# EAGLE schematic RadioLab (EAGLE 6.5.0)
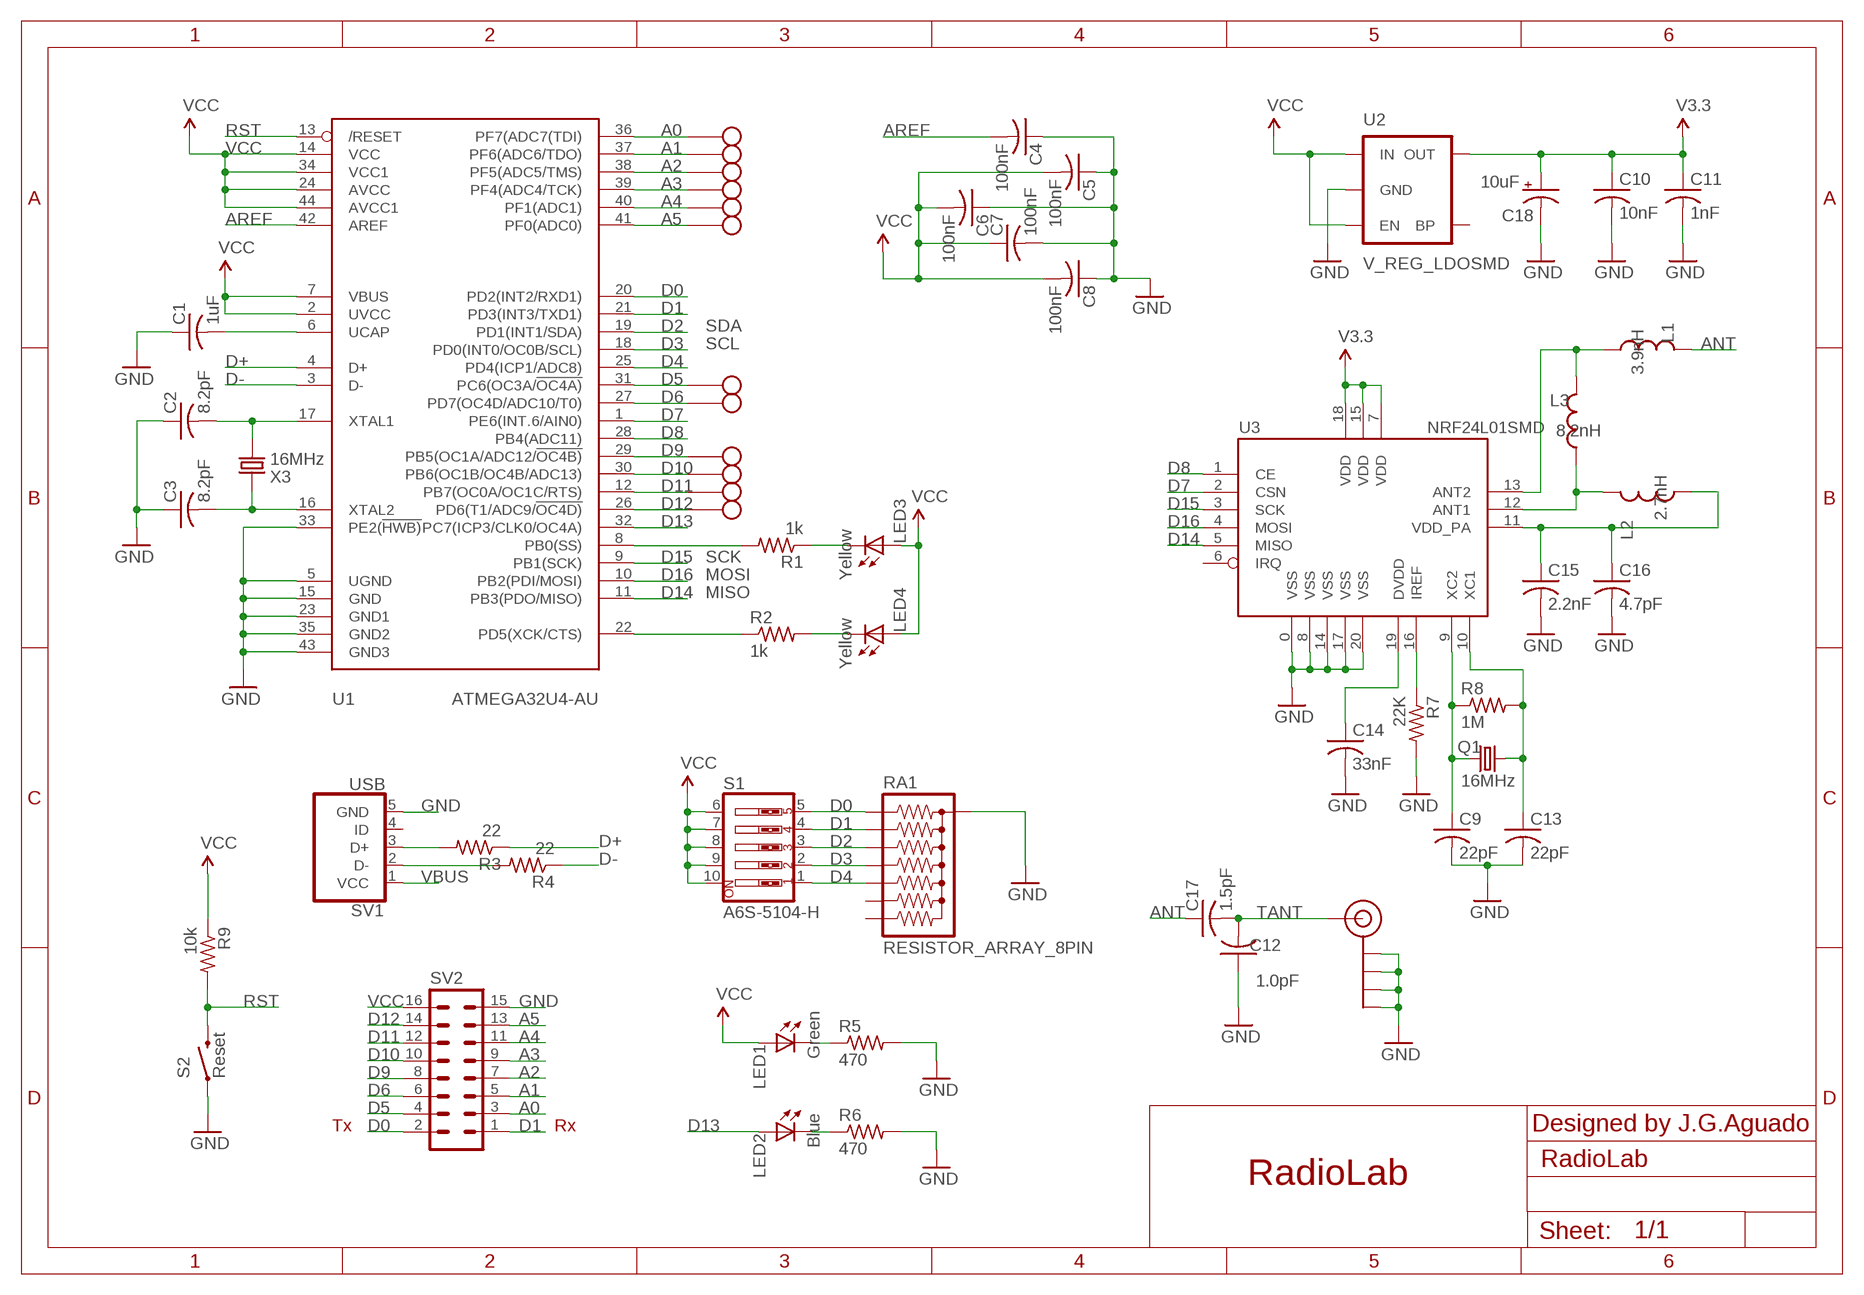
[diagram p0: schematic, sheet 1]

## Parts
ANT  SMA_EDGE  [SMA-EDGE]
C1  1uF  C0402  [0402]
C2  8.2pF  C0402  [0402]
C3  8.2pF  C0402  [0402]
C4  100nF  C0402  [0402]
C5  100nF  C0402  [0402]
C6  100nF  C0402  [0402]
C7  100nF  C0402  [0402]
C8  100nF  C0402  [0402]
C9  22pF  C0402  [0402]
C10  10nF  C0402  [0402]
C11  1nF  C0402  [0402]
C12  1.0pF  C0402  [0402]
C13  22pF  C0402  [0402]
C14  33nF  C0402  [0402]
C15  2.2nF  C0402  [0402]
C16  4.7pF  C0402  [0402]
C17  1.5pF  C0402  [0402]
C18  10uF  CAP_POL1206  [EIA3216]
L1  3.9nH  L0402  [0402]
L2  2.7nH  L0402  [0402]
L3  8.2nH  L0402  [0402]
LED1  Green  LED0402  [LED0402]
LED2  Blue  LED0402  [LED0402]
LED3  Yellow  LED0402  [LED0402]
LED4  Yellow  LED0402  [LED0402]
Q1  16MHz  CRYSTAL5X3  [CRYSTAL-SMD-5X3]
R1  1k  R0402  [0402]
R2  1k  R0402  [0402]
R3  22  R0402  [0402]
R4  22  R0402  [0402]
R5  470  R0402  [0402]
R6  470  R0402  [0402]
R7  22K  R0402  [0402]
R8  1M  R0402  [0402]
R9  10k  R0402  [0402]
RA1  RESISTOR_ARRAY_8PIN  [CRA12E]
S1  A6S-5104-H  [A6S-5104-H]
S2  Reset  SWITCH-MOMENTARY-2SMD-4  [TACTILE_SWITCH_TALL]
SV1  USB  USB-RECEPTABLE  [FCI-10103594-0001LF]
SV2  MA08-2  [MA08-2]
U1  ATMEGA32U4-AU  [TQFP44]
U2  V_REG_LDOSMD  [SOT23-5]
U3  NRF24L01SMD  [QFN20]
U$1  PIN_PAD_CIRCLE_R50  [PAD_5MM]
U$2  PIN_PAD_CIRCLE_R50  [PAD_5MM]
U$3  PIN_PAD_CIRCLE_R50  [PAD_5MM]
U$4  PIN_PAD_CIRCLE_R50  [PAD_5MM]
U$5  PIN_PAD_CIRCLE_R50  [PAD_5MM]
U$6  PIN_PAD_CIRCLE_R50  [PAD_5MM]
U$7  PIN_PAD_CIRCLE_R50  [PAD_5MM]
U$8  PIN_PAD_CIRCLE_R50  [PAD_5MM]
U$9  PIN_PAD_CIRCLE_R50  [PAD_5MM]
U$10  PIN_PAD_CIRCLE_R50  [PAD_5MM]
U$11  PIN_PAD_CIRCLE_R50  [PAD_5MM]
U$12  PIN_PAD_CIRCLE_R50  [PAD_5MM]
X3  16MHz  CRYSTAL'5032'  [2P-SMD-5X3.2]

## Nets
3.3V: C10.1 C11.1 C18.A(+) U2.5(OUT) U3.7(VDD) U3.15(VDD) U3.18(VDD) ; supply symbol labelled V3.3
A0: SV2.3 U1.36(PF7(ADC7(TDI)) U$1.PAD
A1: SV2.5 U1.37(PF6(ADC6/TDO)) U$2.PAD
A2: SV2.7 U1.38(PF5(ADC5/TMS)) U$3.PAD
A3: SV2.9 U1.39(PF4(ADC4/TCK)) U$4.PAD
A4: SV2.11 U1.40(PF1(ADC1)) U$5.PAD
A5: SV2.13 U1.41(PF0(ADC0)) U$6.PAD
ANT: C17.1 L1.2
AREF: C4.2 U1.42(AREF)
D0: RA1.1 S1.5 SV2.2 U1.20(PD2(INT2/RXD1))
D1: RA1.2 S1.4 SV2.1 U1.21(PD3(INT3/TXD1))
D2: RA1.3 S1.3 U1.19(PD1(INT1/SDA))
D3: RA1.4 S1.2 U1.18(PD0(INT0/OC0B/SCL))
D4: RA1.5 S1.1 U1.25(PD4(ICP1/ADC8))
D5: SV2.4 U1.31(PC6(OC3A/!OC4A)) U$7.PAD
D6: SV2.6 U1.27(PD7(OC4D/ADC10/T0)) U$8.PAD
D7: U1.1(PE6(INT.6/AIN0)) U3.2(CSN)
D8: U1.28(PB4(ADC11)) U3.1(CE)
D9: SV2.8 U1.29(PB5(OC1A/ADC12/!OC4B)) U$9.PAD
D10: SV2.10 U1.30(PB6(OC1B/OC4B/ADC13)) U$10.PAD
D11: SV2.12 U1.12(PB7(OC0A/OC1C/RTS)) U$11.PAD
D12: SV2.14 U1.26(PD6(T1/ADC9/!OC4D)) U$12.PAD
D13: LED2.A U1.32(PC7(ICP3/CLK0/OC4A))
D14: U1.11(PB3(PDO/MISO)) U3.5(MISO)
D15: U1.9(PB1(SCK)) U3.3(SCK)
D16: U1.10(PB2(PDI/MOSI)) U3.4(MOSI)
D17/PB0/RXLED1: R1.2 U1.8(PB0(SS))
D+: R3.1 U1.4(D+)
D-: R4.1 U1.3(D-)
GND: ANT.GND@0(GND) ANT.GND@1(GND) ANT.GND@2(GND) ANT.GND@3(GND) C1.1 C2.1 C3.1 C4.1 C5.1 C6.1 C7.2 C8.1 C9.2 C10.2 C11.2 C12.1 C13.2 C14.2 C15.2 C16.2 C18.C(-) R5.2 R6.2 R7.2 RA1.8 S2.A2 SV1.5(GND) SV2.15 U1.5(UGND) U1.15(GND) U1.23(GND1) U1.33(PE2(!HWB)) U1.35(GND2) U1.43(GND3) U2.2(GND) U3.0(VSS) U3.8(VSS) U3.14(VSS) U3.17(VSS) U3.20(VSS)
N$1: C9.1 Q1.1 R8.1 U3.9(XC2)
N$2: R3.2 SV1.3(D+)
N$3: C2.2 U1.17(XTAL1) X3.2
N$4: R4.2 SV1.2(D-)
N$5: C13.1 Q1.3 R8.2 U3.10(XC1)
N$6: LED1.C R5.1
N$7: C3.2 U1.16(XTAL2) X3.1
N$8: L1.1 L3.2 U3.13(ANT2)
N$9: LED2.C R6.1
N$10: C15.1 C16.1 L2.1 U3.11(VDD_PA)
N$11: R7.1 U3.16(IREF)
N$12: C14.1 U3.19(DVDD)
N$13: L2.2 L3.1 U3.12(ANT1)
N$15: LED4.C R2.2
N$16: LED3.C R1.1
PD5/TXLED1: R2.1 U1.22(PD5(XCK/CTS))
RST: R9.2 S2.B2 U1.13(/RESET)
TANT: ANT.SIG(SIGNAL) C12.2 C17.2
UCAP1: C1.2 U1.6(UCAP)
VBUS: SV1.1(VCC)
VCC: C5.2 C6.2 C7.1 C8.2 LED1.A LED3.A LED4.A R9.1 S1.6 S1.7 S1.8 S1.9 S1.10 SV2.16 U1.2(UVCC) U1.7(VBUS) U1.14(VCC) U1.24(AVCC) U1.34(VCC1) U1.44(AVCC1) U2.1(IN) U2.3(EN)
Unconnected: RA1.6 RA1.7 SV1.4(ID) U2.4(BP) U3.6(IRQ)

## Notes on the sheet
- SDA
- SCL
- SCK
- MOSI
- MISO
- Tx | Rx | Designed by J.G.Aguado
- RadioLab

## Library data of the parts
ANT = SparkFun:SMA_EDGE: SMA Antenna Connector End launch SMA connector. The paste layer has been removed so that the connector can be hand soldered onto the board after reflow.
C1-C17 = SpaceDIY_passive_components:C0402
C18 = SparkFun:CAP_POL: Capacitor Polarized These are standard SMD and PTH capacitors. Normally 10uF, 47uF, and 100uF in electrolytic and tantalum varieties. Always verify the external diameter of the through hole cap, it varies with capacity, voltage, and manufacturer. The EIA devices should be standard.
L1-L3 = SpaceDIY_passive_components:L0402
LED1-LED4 = SpaceDIY_passive_components:LED0402
Q1 = SparkFun:CRYSTAL: Crystals Various standard crystals. Proven footprints. Spark Fun Electronics SKU : COM-00534
R1-R9 = SpaceDIY_passive_components:R0402
RA1 = SpaceDIY_IC:RESISTOR_ARRAY_8PIN
S1 = SpaceDIY_connectors:A6S-5104-H
S2 = Testing:SWITCH-MOMENTARY-2: Various NO switches- pushbuttons, reed, etc
SV1 = daspilker:USB-RECEPTABLE: USB Receptable
SV2 = con-lstb:MA08-2: PIN HEADER; OC_FARNELL: unknown; OC_NEWARK: unknown
U1 = adafruit:ATMEGA32U4: http://www.ladyada.net/library/eagle
U2 = SparkFun:V_REG_LDO: Voltage Regulator LDO Standard 150mA LDO voltage regulator in SOT-23 layout. Micrel part MIC5205. BP (by-pass) pin is used to lower output noise with 470pF cap.
U3 = SparkFun:NRF24L01: 2.4GHz Low Power Transceiver This is the very popular, low cost, very low power RF transceiver from Nordic Semiconductor. Simple SPI interface. SKU: COM-00690
U$1-U$12 = SpaceDIY_connectors:PIN_PAD_CIRCLE_R50
X3 = Discrete:CRYSTAL*: CRYSTAL

## Net classes
1 vcc: width 0.254 mm